# EAGLE design display_spi (EAGLE 9.6.2)
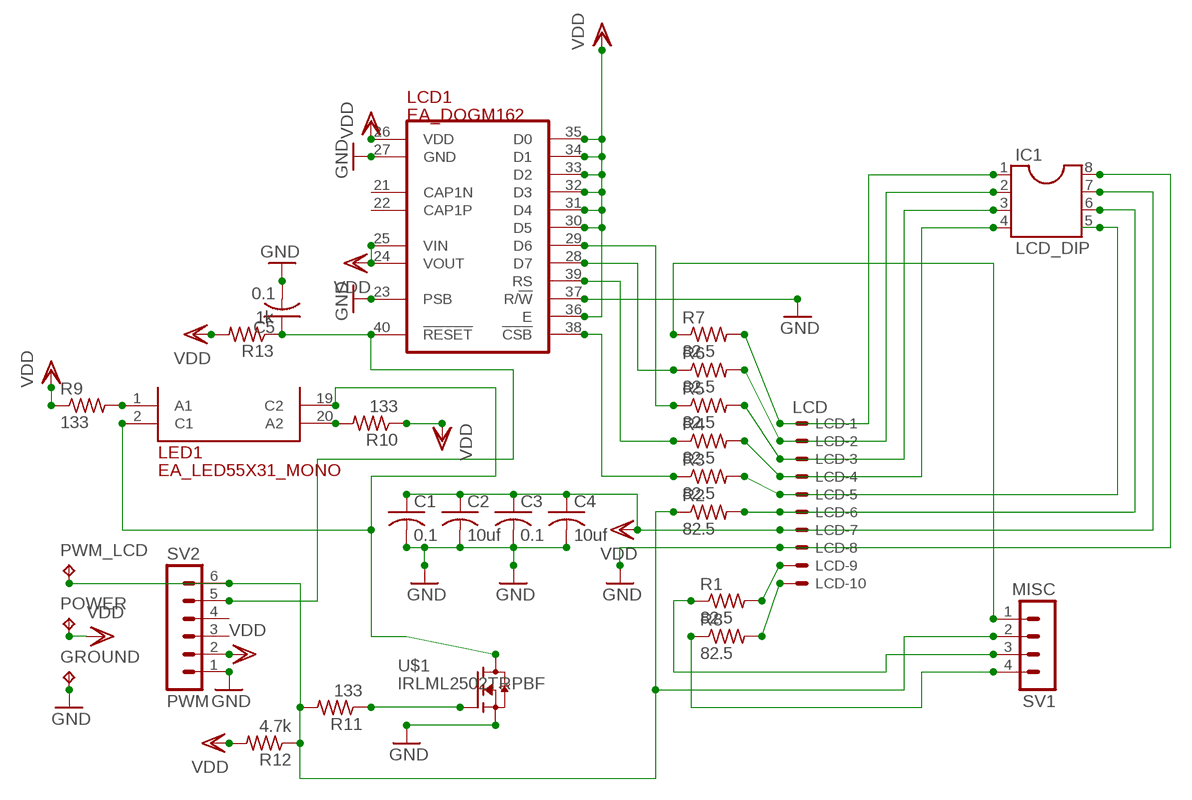
[diagram p0: schematic, sheet 1]

## Parts
C1  0.1  C-USC1206  [C1206]
C2  10uf  C-USC1206  [C1206]
C3  0.1  C-USC1206  [C1206]
C4  10uf  C-USC1206  [C1206]
C5  0.1  C-USC1206  [C1206]
GROUND  TPB1,27  [B1,27]
IC1  LCD_DIP  DIL8S  [SOCKET-08]
LCD  LCD  22-23-2101  [22-23-2101]
LCD1  EA_DOGM162  [EA_DOGM]
LED1  EA_LED55X31_MONO  [EA_LED55X31]
POWER  TPB1,27  [B1,27]
PWM_LCD  PWM  TPB1,27  [B1,27]
R1  82.5  R-US_R0805  [R0805]
R2  82.5  R-US_R0805  [R0805]
R3  82.5  R-US_R0805  [R0805]
R4  82.5  R-US_R0805  [R0805]
R5  82.5  R-US_R0805  [R0805]
R6  82.5  R-US_R0805  [R0805]
R7  82.5  R-US_R0805  [R0805]
R8  82.5  R-US_R0805  [R0805]
R9  133  R-US_R1206  [R1206]
R10  133  R-US_R1206  [R1206]
R11  133  R-US_R1206  [R1206]
R12  4.7k  R-US_R1206  [R1206]
R13  1k  R-US_R1206  [R1206]
SV1  MISC  MA04-1  [MA04-1]
SV2  PWM  MA06-1  [MA06-1]
U$1  IRLML2502TRPBF  [SOT23]

## Nets
GND [i-lines]: C1.2 C2.2 C3.2 C4.2 C5.2 GROUND.TP IC1.8 LCD1.23(PSB) LCD1.27(GND) LCD1.37(R/!W!) LCD.8 SV2.1 U$1.2(S)
N$1: IC1.1 LCD.1 R7.2
N$2: IC1.2 LCD.2 R6.2
N$3: IC1.3 LCD.3 R5.2
N$4: IC1.4 LCD.4 R4.2
N$5: IC1.5 LCD.5 R3.2
N$6: IC1.6 LCD.6 R2.2
N$7: LCD.9 R1.2
N$8: LCD.10 R8.2
N$9: LCD1.28(D7) R6.1
N$10: LCD1.29(D6) R5.1
N$11: LCD1.39(RS) R4.1
N$12: LCD1.38(!CSB!) R3.1
N$13: R7.1 SV1.1
N$14: PWM_LCD.TP R2.1 R11.2 R12.1 SV1.2 SV2.6
N$15: R1.1 SV1.3
N$16: R8.1 SV1.4
N$17 [i-lines]: LED1.1(A1) R9.2
N$18 [i-lines]: LED1.20(A2) R10.2
N$19 [i-lines]: LED1.2(C1) LED1.19(C2) U$1.3(D)
N$20: C5.1 LCD1.40(!RESET!) R13.1 SV2.5
N$21: R11.1 U$1.1(G)
VDD [i-lines]: C1.1 C2.1 C3.1 C4.1 IC1.7 LCD1.24(VOUT) LCD1.25(VIN) LCD1.26(VDD) LCD1.30(D5) LCD1.31(D4) LCD1.32(D3) LCD1.33(D2) LCD1.34(D1) LCD1.35(D0) LCD1.36(E) LCD.7 POWER.TP R9.1 R10.1 R12.2 R13.2 SV2.2
Unconnected: LCD1.21(CAP1N) LCD1.22(CAP1P) SV2.3 SV2.4

## Library data of the parts
C1-C5 = rcl:C-US: CAPACITOR, American symbol; SPICEPREFIX: C
GROUND POWER PWM_LCD = testpad:TP: Test pad
IC1 = ic-package:DIL8: Dual In Line / Socket
LCD = con-molex:22-23-2101: .100" (2.54mm) Center Header - 10 Pin; MF: MOLEX; MPN: 22-23-2101; OC_FARNELL: 1756828; OC_NEWARK: 94C0765
LCD1 = ea_v66:EA_DOGM162: ELECTRONIC ASSEMBYL GmbH EA DOGM162-A EA DOGM081-A EA DOGM163-A
LED1 = ea_v66:EA_LED55X31_MONO
R1-R13 = rcl:R-US_: RESISTOR, American symbol; SPICEPREFIX: R
SV1 = con-lstb:MA04-1: PIN HEADER; OC_FARNELL: unknown; OC_NEWARK: unknown
SV2 = con-lstb:MA06-1: PIN HEADER; OC_FARNELL: unknown; OC_NEWARK: unknown
U$1 = IRLML2502TRPBF:IRLML2502TRPBF; DESCRIPTION: Single N-Channel 20 V 0.08 Ohm 12 nC 1.25 W Silicon SMT Mosfet - SOT-23; DIGI-KEY_PART_NUMBER: IRLML2502TRPBFCT-ND; DIGI-KEY_PURCHASE_URL: https://www.digikey.com/product-detail/en/infineon-technologies/IRLML2502TRPBF/IRLML2502TRPBFCT-ND/812502?utm_source=snapeda&utm_medium=aggregator&utm_campaign=symbol; MF: Infineon; MP: IRLML2502TRPBF; PACKAGE: SOT-23-3 Infineon

## Net classes
1 i-lines: width 0.5 mm

## Board
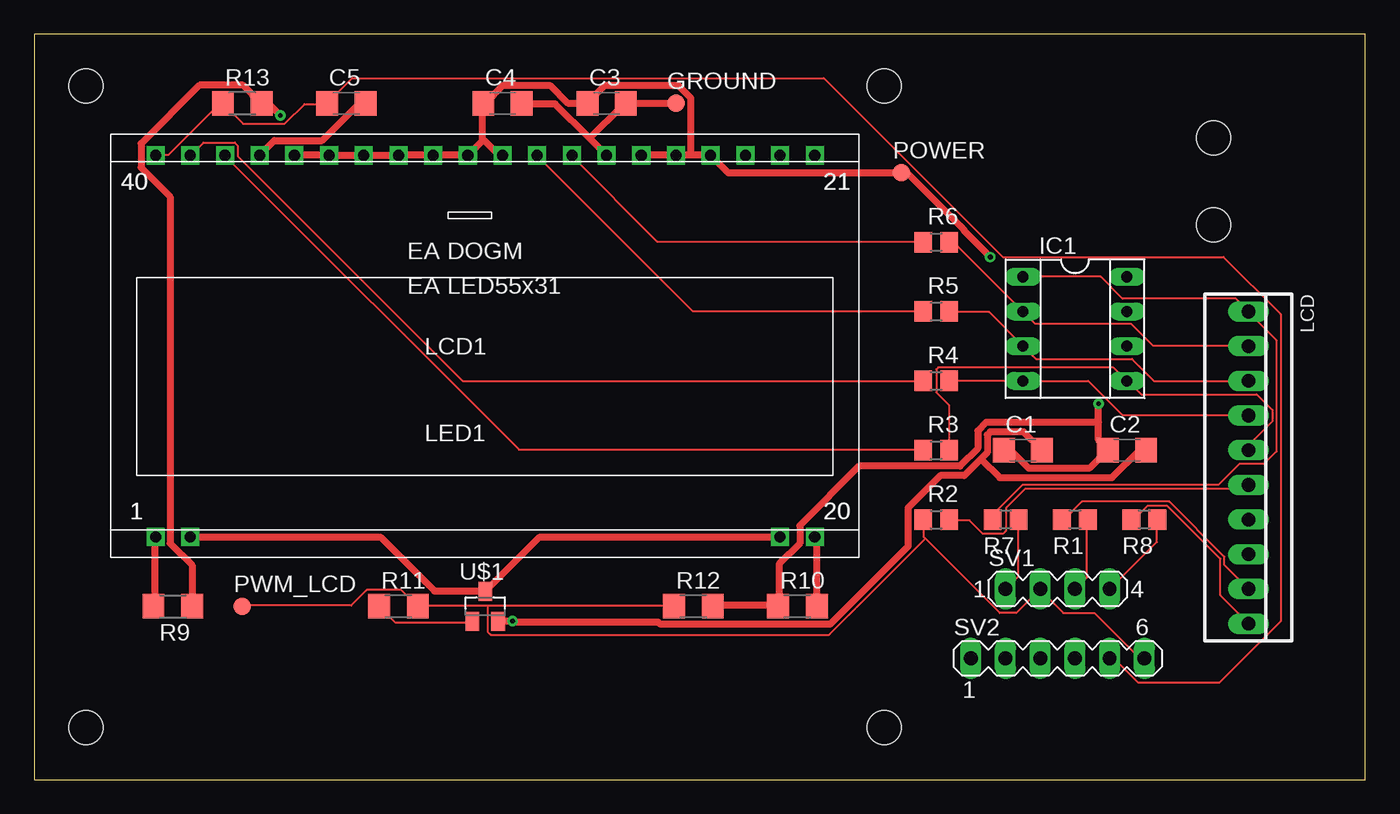
[diagram p1: board, top side]
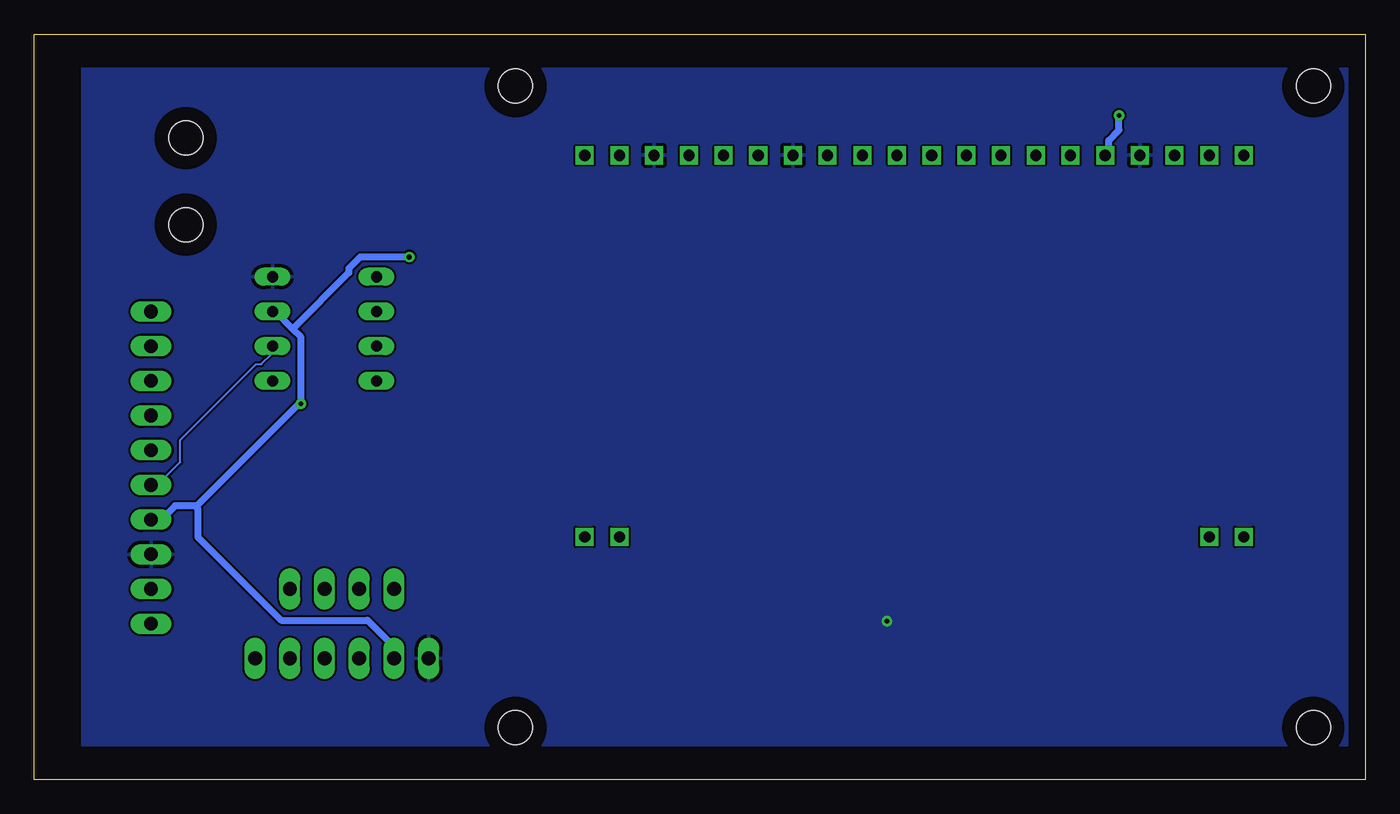
[diagram p2: board, bottom side, seen from below]

Size 97.46 x 54.6 mm. Coordinates in mm from the lower left corner, seen from the top.
Outline: 0,0 97.46,0 97.46,54.6 0,54.6 0,0
Copper layers (1*16): Top 0.035mm / dielectric 1.5mm / Bottom 0.035mm
Design rules "default": minimum track width 6mil, minimum drill 0.35mm, track to track 6mil, track to pad 6mil, pad to pad 6mil, via to via 6mil, smd to smd 6mil, copper to edge 40mil, drill to drill 6mil, minimum pad ring 10mil, minimum via ring 8mil, stop-mask expansion 4mil, vias tented up to drill 0mil, thermal gap 10mil
Holes 2.5 mm at 3.81,3.81 3.81,50.8 62.23,50.8 62.23,3.81 86.36,46.99 86.36,40.64

### Footprints (pad centres in the part's own frame; a part is rotated, then mirrored left to right if it is on the bottom)
C1206 = smd 1.6 x 1.8: 1 -1.4,0; 2 1.4,0
B1,27 = smd 1.27 x 1.27: TP 0,0
SOCKET-08 = drill 0.813 long: 1 -3.81,-3.81; 2 -1.27,-3.81; 3 1.27,-3.81; 4 3.81,-3.81; 5 3.81,3.81; 6 1.27,3.81; 7 -1.27,3.81; 8 -3.81,3.81
22-23-2101 = drill 1 long: 1 -11.43,0; 2 -8.89,0; 3 -6.35,0; 4 -3.81,0; 5 -1.27,0; 6 1.27,0; 7 3.81,0; 8 6.35,0; 9 8.89,0; 10 11.43,0
EA_DOGM = drill 0.813 square: 21 48.26,27.94; 22 45.72,27.94; 23 43.18,27.94; 24 40.64,27.94; 25 38.1,27.94; 26 35.56,27.94; 27 33.02,27.94; 28 30.48,27.94; 29 27.94,27.94; 30 25.4,27.94; 31 22.86,27.94; 32 20.32,27.94; 33 17.78,27.94; 34 15.24,27.94; 35 12.7,27.94; 36 10.16,27.94; 37 7.62,27.94; 38 5.08,27.94; 39 2.54,27.94; 40 0,27.94
EA_LED55X31 = drill 0.813 square: 1 0,0; 2 2.54,0; 19 45.72,0; 20 48.26,0
R0805 = smd 1.3 x 1.5: 1 -0.95,0; 2 0.95,0
R1206 = smd 1.6 x 1.803: 1 -1.422,0; 2 1.422,0
MA04-1 = drill 1.016 long: 1 -3.81,0; 2 -1.27,0; 3 1.27,0; 4 3.81,0
MA06-1 = drill 1.016 long: 1 -6.35,0; 2 -3.81,0; 3 -1.27,0; 4 1.27,0; 5 3.81,0; 6 6.35,0
SOT23 = smd 1 x 1.4: 1 -0.95,-1.1; 2 0.95,-1.1; 3 0,1.1

### Placement (x,y rotation side)
C1  72.39,24.13 0 top
C2  80.01,24.13 0 top
C3  41.91,49.53 0 top
C4  34.29,49.53 0 top
C5  22.86,49.53 0 top
GROUND  46.99,49.53 0 top
IC1  76.2,33.02 270 top
LCD  88.9,22.86 270 top
LCD1  8.89,17.78 0 top
LED1  8.89,17.78 0 top
POWER  63.5,44.45 0 top
PWM_LCD  15.24,12.7 0 top
R1  76.2,19.05 180 top
R2  66.04,19.05 0 top
R3  66.04,24.13 0 top
R4  66.04,29.21 0 top
R5  66.04,34.29 0 top
R6  66.04,39.37 0 top
R7  71.12,19.05 180 top
R8  81.28,19.05 180 top
R9  10.16,12.7 180 top
R10  55.88,12.7 0 top
R11  26.67,12.7 0 top
R12  48.26,12.7 0 top
R13  15.24,49.53 0 top
SV1  74.93,13.97 0 top
SV2  74.93,8.89 0 top
U$1  33.02,12.7 0 top

### Tracks (layer width: path | path; a pad name or v marks a point on that pad's centre or on a via)
GND  (via drill 0.35)
  Top 0.5: GROUND.TP 46.99,49.55 43.33,49.55 C3.2 43.1,49.4 40.66,46.97 | U$1.2 34.04,11.61 v35.03,11.61 35.25,11.53 45.7,11.53 45.85,11.38 58.27,11.38 63.98,17.09 63.98,19.91 66.34,22.28 68.1,22.28 69.32,23.5 | 69.32,23.5 69.77,23.95 69.77,25.25 70,25.48 72.44,25.48 73.74,24.18 C1.2 | C5.2 24.21,49.48 23.75,49.48 21.08,46.81 17.58,46.81 16.51,45.75 LCD1.37 | LCD1.27 40.66,46.97 | 40.66,46.97 38.15,49.48 35.71,49.48 C4.2 | 69.32,23.5 70.69,22.12 78.92,22.12 80.9,24.11 81.36,24.11 C2.2
  pour Bottom: 1.27,52.07 93.98,52.07 93.98,2.54 1.27,2.54
N$1
  Top 0.152: R7.2 70.23,19.07 70.23,19.46 72.36,21.59 86.69,21.59 88.21,23.11 90.04,23.11 90.96,24.03 90.96,32.18 88.9,34.24 LCD.1 88.9,34.31 87.99,35.23 79.68,35.23 78.08,36.83 IC1.1
N$2
  Top 0.152: R6.2 67.03,39.34 67.33,39.34 IC1.2 73.28,33.4 80.29,33.4 81.89,31.8 88.9,31.8 LCD.2
N$3
  Top 0.152: R5.2 67.03,34.24 69.93,34.24 72.36,31.8 IC1.3 72.44,31.72 73.36,30.81 80.37,30.81 81.97,29.21 LCD.3
N$4
  Top 0.152: R4.2 IC1.4 77.16,29.21 79.68,26.69 88.9,26.69 LCD.4
N$5
  Top 0.152: R3.2 66.95,24.18 66.95,27.46 66.04,28.37 66.04,30.05 66.19,30.2 78.99,30.2 79.98,29.21 IC1.5 80.06,29.21 81.05,28.22 89.51,28.22 90.65,27.08 90.65,26.24 88.9,24.49 LCD.5
N$6
  Top 0.152: LCD.6 88.59,21.29 72.52,21.29 71.14,19.91 71.14,18.24 70.92,18.01 69.47,18.01 68.48,19 67.03,19 R2.2
  Bottom 0.152: LCD.6 88.44,21.59 86.77,23.27 86.77,24.87 81.2,30.43 80.82,30.43 80.06,31.19 80.06,31.72 IC1.6
N$7
  Top 0.152: LCD.9 87.15,15.72 87.15,16.33 83.11,20.37 76.71,20.37 75.41,19.07 75.26,19.07 R1.2
N$8
  Top 0.152: R8.2 80.37,19.07 80.52,19.07 81.51,20.07 82.96,20.07 86.84,16.18 86.84,13.51 88.9,11.45 LCD.10
N$9
  Top 0.152: R6.1 65.05,39.42 45.62,39.42 39.37,45.67 LCD1.28
N$10
  Top 0.152: R5.1 65.05,34.31 48.21,34.31 36.85,45.67 LCD1.29
N$11
  Top 0.152: R4.1 31.37,29.21 14.91,45.67 14.91,46.43 14.68,46.66 12.39,46.66 11.48,45.75 LCD1.39
N$12
  Top 0.152: R3.1 65.05,24.18 35.48,24.18 13.99,45.67 LCD1.38
N$13
  Top 0.152: R7.1 72.06,19 72.06,14.88 71.14,13.97 SV1.1
N$14
  Top 0.152: 65.24,17.67 70.69,12.22 71.91,12.22 SV1.2 73.66,13.89 75.34,12.22 77.62,12.22 80.9,8.94 81.28,8.94 SV2.6 | 65.24,17.67 65.13,17.78 65.13,19 R2.1 | PWM_LCD.TP 15.29,12.75 23.22,12.75 24.36,13.89 26.87,13.89 28.02,12.75 R11.2 28.09,12.75 33.2,12.75 | 33.2,12.75 46.84,12.75 R12.1 | 65.24,17.67 58.19,10.62 33.43,10.62 33.2,10.85 33.2,12.75
N$15
  Top 0.152: R1.1 77.09,19 77.09,14.81 76.25,13.97 SV1.3
N$16
  Top 0.152: R8.1 82.19,19 82.19,17.4 78.77,13.97 SV1.4
N$17
  Top 0.5: LED1.1 8.81,17.7 8.81,12.75 R9.2
N$18
  Top 0.5: R10.2 57.28,12.75 57.28,17.7 57.2,17.78 LED1.20
N$19
  Top 0.5: LED1.2 25.35,17.78 29.31,13.82 32.97,13.82 U$1.3 33.2,13.97 37.01,17.78 LED1.19
N$20
  Top 0.152: LCD1.40 8.89,45.75 9.8,45.75 13.54,49.48 13.77,49.48 R13.1 13.84,49.48 15.29,48.03 18.34,48.03 19.79,49.48 21.39,49.48 C5.1 21.46,49.55 23.29,51.38 57.81,51.38 70.92,38.28 87.07,38.28 91.26,34.09 91.26,11.61 86.77,7.11 80.82,7.11 79.07,8.86 78.77,8.86 SV2.5
N$21
  Top 0.152: U$1.1 32.05,11.53 26.42,11.53 25.27,12.67 R11.1
VDD  (via drill 0.35)
  Top 0.5: R12.2 49.73,12.75 54.46,12.75 R10.1 54.53,12.98 54.53,15.8 56.06,17.32 56.06,18.62 60.4,22.96 67.79,22.96 69.09,24.26 69.09,25.55 69.7,26.16 77.93,26.16 | C1.1 70.99,24.11 71.53,24.11 72.82,22.81 77.24,22.81 78.54,24.11 C2.1 78.46,24.33 77.93,24.87 77.93,26.16 | 77.93,26.16 v77.93,27.53 | R9.1 11.56,12.75 11.56,15.72 9.96,17.32 9.96,42.7 7.82,44.83 7.82,46.58 12.09,50.85 15.29,50.85 16.59,49.55 R13.2 16.89,49.48 17.2,49.48 v18.03,48.64 | LCD1.26 44.48,45.75 46.99,45.75 LCD1.25 47.22,45.75 48.06,45.75 | 48.06,45.75 49.35,45.75 LCD1.24 50.8,44.45 POWER.TP 63.68,44.3 64.06,44.3 68.1,40.26 68.1,40.18 v70,38.28 | LCD1.36 19.1,45.75 21.54,45.75 LCD1.35 21.84,45.75 24.13,45.75 LCD1.34 24.36,45.75 26.64,45.75 LCD1.33 26.87,45.75 29.01,45.75 LCD1.32 29.23,45.75 31.52,45.75 LCD1.31 31.75,45.75 32.82,46.81 | 32.82,46.81 32.82,49.48 C4.1 33.12,49.63 34.34,50.85 37.77,50.85 39.06,49.55 40.44,49.55 C3.1 40.66,49.71 41.81,50.85 47.14,50.85 48.06,49.94 48.06,45.75 | LCD1.30 34.27,45.75 34.04,45.75 33.05,46.74 32.82,46.81
  Bottom 0.5: 78.54,33.02 77.93,32.41 v77.93,27.53 78.16,27.46 85.55,20.07 | 78.54,33.02 79.76,34.24 79.98,34.24 IC1.7 | 85.55,20.07 87.15,20.07 88.14,19.07 88.9,19.07 LCD.7 | SV2.2 71.14,8.94 71.14,9.78 73.05,11.68 79.38,11.68 85.47,17.78 85.47,19.84 85.55,20.07 | v18.03,48.64 18.03,47.57 18.8,46.81 18.8,45.97 LCD1.36 | 78.54,33.02 74.42,37.14 74.42,37.44 73.58,38.28 v70,38.28